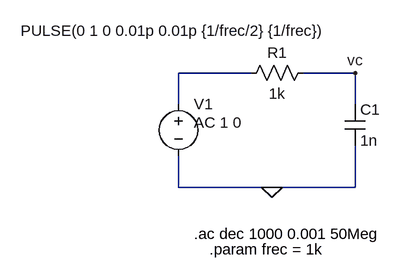
[diagram p0: schematic Draft22.asc]
Draft22.asc, the LTspice schematic file:
Version 4
SHEET 1 880 680
WIRE 144 80 32 80
WIRE 304 80 224 80
WIRE 32 128 32 80
WIRE 304 128 304 80
WIRE 32 256 32 208
WIRE 176 256 32 256
WIRE 304 256 304 192
WIRE 304 256 176 256
FLAG 176 256 0
FLAG 304 80 vc
SYMBOL voltage 32 112 R0
WINDOW 3 -243 -97 Left 2
WINDOW 123 24 44 Left 2
WINDOW 39 0 0 Left 0
SYMATTR InstName V1
SYMATTR Value PULSE(0 1 0 0.01p 0.01p {1/frec/2} {1/frec})
SYMATTR Value2 AC 1 0
SYMBOL res 240 64 R90
WINDOW 0 0 56 VBottom 2
WINDOW 3 32 56 VTop 2
SYMATTR InstName R1
SYMATTR Value 1k
SYMBOL cap 288 128 R0
SYMATTR InstName C1
SYMATTR Value 1n
TEXT 56 328 Left 2 !.ac dec 1000 0.001 50Meg
TEXT 80 352 Left 2 !.param frec = 1k

The netlist it stands for:
* Draft22.asc
V1 N001 0 PULSE(0 1 0 0.01p 0.01p {1/frec/2} {1/frec}) AC 1 0
R1 vc N001 1k
C1 vc 0 1n
.ac dec 1000 0.001 50Meg
.param frec = 1k
.backanno
.end